# EAGLE design uc4h vl53lxx v0100 (EAGLE 7.5.0)
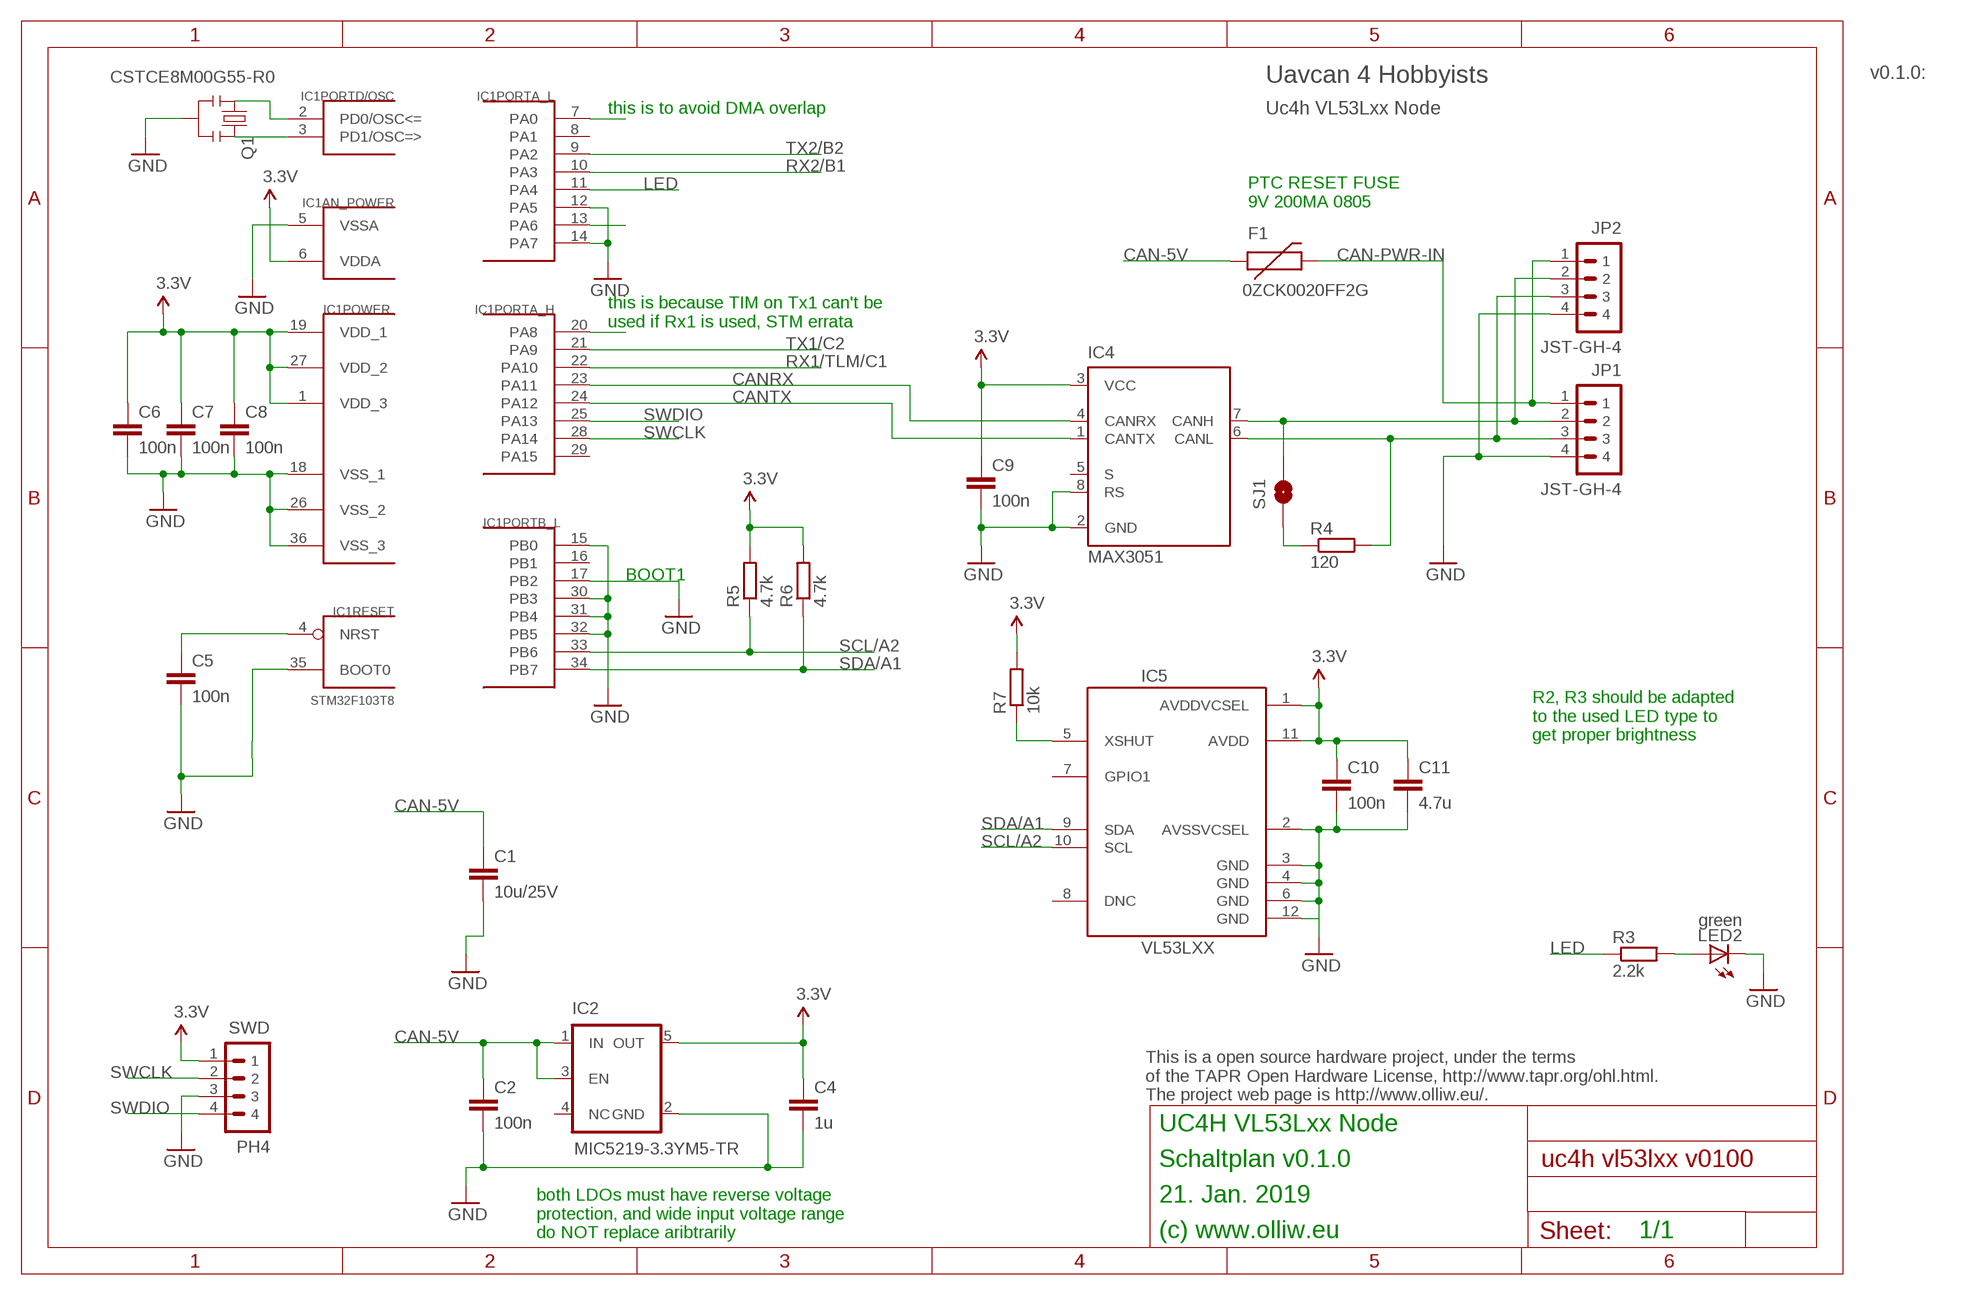
[diagram p0: schematic, sheet 1]

## Parts
C1  10u/25V  C-EUC1206  [C1206]
C2  100n  C-EUC0603K  [C0603K]
C4  1u  C-EUC0603K  [C0603K]
C5  100n  C-EUC0402  [C0402]
C6  100n  C-EUC0402  [C0402]
C7  100n  C-EUC0402  [C0402]
C8  100n  C-EUC0402  [C0402]
C9  100n  C-EUC0402  [C0402]
C10  100n  C-EUC0402  [C0402]
C11  4.7u  C-EUC0603K  [C0603K]
F1  0ZCK0020FF2G  FUSE-PTCFUSE-0805  [FUSE-0805]
IC1  STM32F103T8  STM32F10XTXU6  [VFQFPN36]
IC2  MIC5219-3.3YM5-TR  V_REG_TPS76433SOT23-5  [SOT23-5]
IC4  MAX3051  [SOT23-8]
IC5  VL53LXX  [VL53LXX]
JP1  JST-GH-4  [SM04B-GHS-TB]
JP2  JST-GH-4  [SM04B-GHS-TB]
LED2  green  LEDCHIPLED_0603  [CHIPLED_0603]
Q1  CSTCE8M00G55-R0  RESONATORSMD  [RESONATOR-SMD]
R3  2.2k  R-EU_R0402  [R0402]
R4  120  R-EU_R0402  [R0402]
R5  4.7k  R-EU_R0402  [R0402]
R6  4.7k  R-EU_R0402  [R0402]
R7  10k  R-EU_R0402  [R0402]
SJ1  SOLDERJUMPERNO  [SJ_2S-NO]
SWD  PH4  P4X1_1P27-OCT_BILEX  [4X1_1P27_OCT_BILEX]

## Nets
3.3V: C4.1 C6.1 C7.1 C8.1 C9.1 C10.1 C11.1 IC1.1(POWER:VDD_3) IC1.6(AN_POWER:VDDA) IC1.19(POWER:VDD_1) IC1.27(POWER:VDD_2) IC2.5(OUT) IC4.3(VCC) IC5.1(AVDDVCSEL) IC5.11(AVDD) R5.2 R6.2 R7.2 SWD.1
CAN-5V: C1.1 C2.1 F1.1 IC2.1(IN) IC2.3(EN)
CAN-PWR-IN: F1.2 JP1.1 JP2.1
CANH: IC4.7(CANH) JP1.2 JP2.2 SJ1.2
CANL: IC4.6(CANL) JP1.3 JP2.3 R4.2
CANRX: IC1.23(PORTA_H:PA11) IC4.4(CANRX)
CANTX: IC1.24(PORTA_H:PA12) IC4.1(CANTX)
GND: C1.2 C2.2 C4.2 C5.2 C6.2 C7.2 C8.2 C9.2 C10.2 C11.2 IC1.5(AN_POWER:VSSA) IC1.12(PORTA_L:PA5) IC1.14(PORTA_L:PA7) IC1.15(PORTB_L:PB0) IC1.17(PORTB_L:PB2) IC1.18(POWER:VSS_1) IC1.26(POWER:VSS_2) IC1.30(PORTB_L:PB3) IC1.31(PORTB_L:PB4) IC1.32(PORTB_L:PB5) IC1.35(RESET:BOOT0) IC1.36(POWER:VSS_3) IC2.2(GND) IC4.2(GND) IC4.8(RS) IC5.2(AVSSVCSEL) IC5.3(GND) IC5.4(GND) IC5.6(GND) IC5.12(GND) JP1.4 JP2.4 LED2.C Q1.2 SWD.3
LED: IC1.11(PORTA_L:PA4) R3.1
N$1: C5.1 IC1.4(RESET:NRST)
N$2: LED2.A R3.2
N$4: R4.1 SJ1.1
N$5: IC1.2(PORTD/OSC:PD0/OSC<=) Q1.1
N$6: IC1.3(PORTD/OSC:PD1/OSC=>) Q1.3
N$7: IC1.7(PORTA_L:PA0)
N$8: IC5.5(XSHUT) R7.1
N$9: IC1.13(PORTA_L:PA6)
N$10: IC1.20(PORTA_H:PA8)
RX1/TLM/C1: IC1.22(PORTA_H:PA10)
RX2/B1: IC1.10(PORTA_L:PA3)
SCL/A2: IC1.33(PORTB_L:PB6) IC5.10(SCL) R5.1
SDA/A1: IC1.34(PORTB_L:PB7) IC5.9(SDA) R6.1
SWCLK: IC1.28(PORTA_H:PA14) SWD.2
SWDIO: IC1.25(PORTA_H:PA13) SWD.4
TX1/C2: IC1.21(PORTA_H:PA9)
TX2/B2: IC1.9(PORTA_L:PA2)
Unconnected: IC1.8(PORTA_L:PA1) IC1.16(PORTB_L:PB1) IC1.29(PORTA_H:PA15) IC2.4(NC) IC4.5(S) IC5.7(GPIO1) IC5.8(DNC)

## Notes on the sheet
- v0.1.0:
- Uavcan 4 Hobbyists
- Uc4h VL53Lxx Node
- this is to avoid DMA overlap
- PTC RESET FUSE
  9V 200MA 0805
- this is because TIM on Tx1 can't be
  used if Rx1 is used, STM errata
- BOOT1
- R2, R3 should be adapted
  to the used LED type to
  get proper brightness
- This is a open source hardware project, under the terms
  of the TAPR Open Hardware License, http://www.tapr.org/ohl.html.
  The project web page is http://www.olliw.eu/.
- UC4H VL53Lxx Node
- Schaltplan v0.1.0
- 21. Jan. 2019
- both LDOs must have reverse voltage
  protection, and wide input voltage range
  do NOT replace aribtrarily
- (c) www.olliw.eu | 1/1

## Library data of the parts
C1 C2 C4-C11 = rcl:C-EU: CAPACITOR, European symbol
F1 = # stdlib:FUSE-PTC
IC1 = # stm32:STM32F10XTXU6: STM32F101/103 36pad VFQPFN36
IC2 = # SparkFun2:V_REG_TPS76433: Voltage Regulator Older TI part. LDO 150mA regulator. No output by-pass cap option. See V_REG_LDO for a better part.
IC4 = # stdlib:MAX3051
IC5 = # stdlib:VL53LXX
JP1 JP2 = # stdlib:JST-GH-4
LED2 = led:LED: LED OSRAM: - CHIPLED LG R971, LG N971, LY N971, LG Q971, LY Q971, LO R971, LY R971 LH N974, LH R974 LS Q976, LO Q976, LY Q976 LO Q996 - Hyper CHIPLED LW Q18S LB Q993, LB Q99A, LB R99A - SideLED LS A670, LO A670, LY A670, LG A670, LP A670 LB A673, LV A673, LT A673, LW A673 LH A674 LY A675 LS A676, LA A676, LO A676, LY A676, LW A676 LS A679, LY A679, LG A679 - Hyper Micro SIDELED® LS Y876, LA Y876, LO Y876, LY Y876 LT Y87S - SmartLED LW L88C, LW L88S LB L89C, LB L89S, LG L890 LS L89K, LO L89K, LY L89K LS L896, LA L896, LO L896, LY L896 - TOPLED LS T670, LO T670, LY T670, LG T670, LP T670 LSG T670, LSP T670, LSY T670, LOP T670, LYG T670 LG T671, LOG T671, LSG T671 LB T673, LV T673, LT T673, LW T673 LH T674 LS T676, LA T676, LO T676, LY T676, LB T676, LH T676, LSB T676, LW T676 LB T67C, LV T67C, LT T67C, LS T67K, LO T67K, LY T67K, LW E67C LS E67B, LA E67B, LO E67B, LY E67B, LB E67C, LV E67C, LT E67C LW T67C LS T679, LY T679, LG T679 LS T770, LO T770, LY T770, LG T770, LP T770 LB T773, LV T773, LT T773, LW T773 LH T774 LS E675, LA E675, LY E675, LS T675 LS T776, LA T776, LO T776, LY T776, LB T776 LHGB T686 LT T68C, LB T68C - Hyper Mini TOPLED® LB M676 - Mini TOPLED Santana® LG M470 LS M47K, LO M47K, LY M47K Source: http://www.osram.convergy.de LUXEON: - LUMILED® LXK2-PW12-R00, LXK2-PW12-S00, LXK2-PW14-U00, LXK2-PW14-V00 LXK2-PM12-R00, LXK2-PM12-S00, LXK2-PM14-U00 LXK2-PE12-Q00, LXK2-PE12-R00, LXK2-PE12-S00, LXK2-PE14-T00, LXK2-PE14-U00 LXK2-PB12-K00, LXK2-PB12-L00, LXK2-PB12-M00, LXK2-PB14-N00, LXK2-PB14-P00, LXK2-PB14-Q00 LXK2-PR12-L00, LXK2-PR12-M00, LXK2-PR14-Q00, LXK2-PR14-R00 LXK2-PD12-Q00, LXK2-PD12-R00, LXK2-PD12-S00 LXK2-PH12-R00, LXK2-PH12-S00 LXK2-PL12-P00, LXK2-PL12-Q00, LXK2-PL12-R00 Source: www.luxeon.com KINGBRIGHT: KA-3528ASYC Source: www.kingbright.com
Q1 = # SparkFun2:RESONATOR: Resonator Small SMD resonator. This is the itty bitty 10/20MHz resonators with built in caps. CSTCE10M0G55 and CSTCE20M0V53. Footprint has been reviewed closely but hasn't been tested yet.
R3-R7 = rcl:R-EU_: RESISTOR, European symbol
SJ1 = # SparkFun2:SOLDERJUMPER: Solder Jumper Standard SMD solder jumper. Used to automate production. Two varients : Normally Open and Normally Closed are the same, but have different paste layers. NC will have a large amount of paste and should jumper during reflow.
SWD = # stdlib:P4X1_1P27

## Board
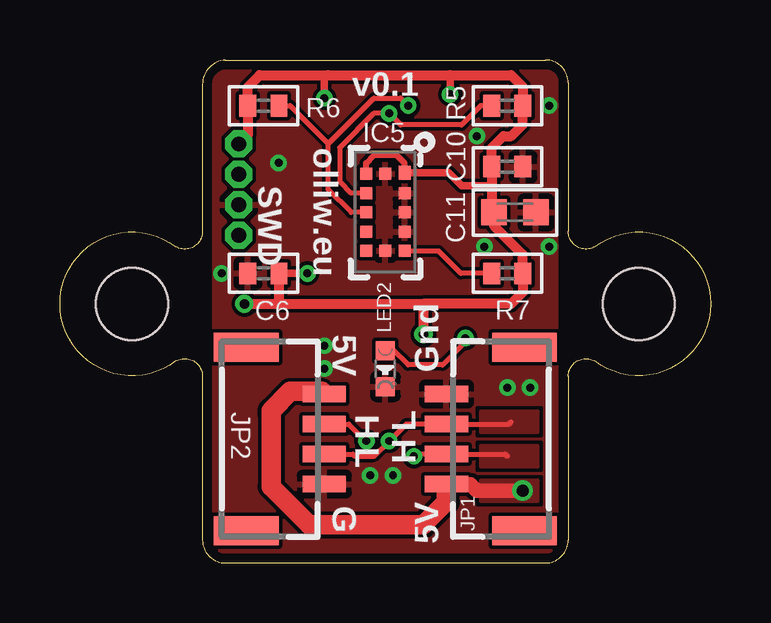
[diagram p1: board, top side]
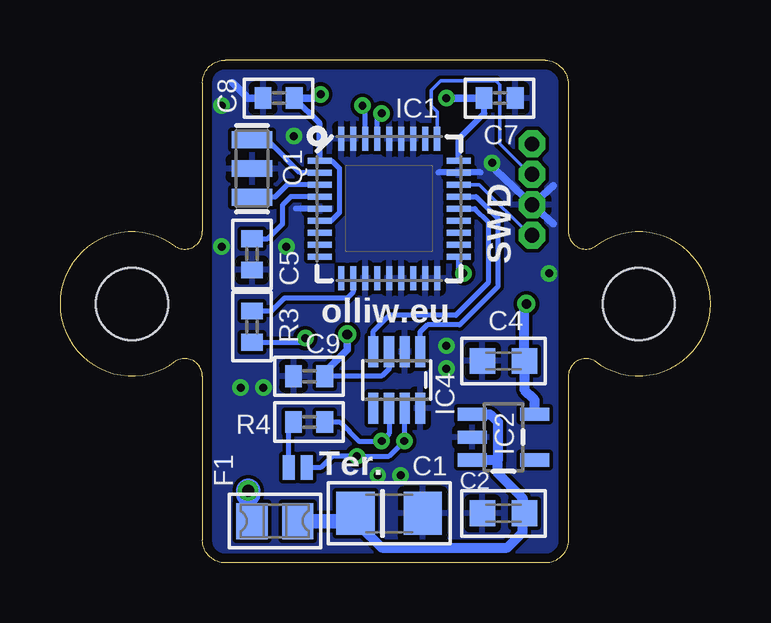
[diagram p2: board, bottom side, seen from below]

Size 27.11 x 20.95 mm. Coordinates in mm from the lower left corner, seen from the top.
Outline: 6.89,0 20.22,0 arc90 21.18,0.95 21.18,7.78 arc-120 22.29,8.41 arc255 22.29,13.18 arc-120 21.18,13.81 21.18,20 arc90 20.22,20.95 6.89,20.95 arc90 5.94,19.84 5.94,13.81 arc-120 4.83,13.18 arc255 4.83,8.41 arc-120 5.94,7.78 5.94,0.95 arc90 6.89,0
Copper layers (1*16): Top 0.0356mm / dielectric 1.5011mm / Bottom 0.0356mm
Design rules "ow-oshpark-2layer": minimum track width 6mil, minimum drill 13mil, track to track 6mil, track to pad 6mil, pad to pad 6mil, via to via 6mil, smd to smd 6mil, copper to edge 15mil, drill to drill 6mil, minimum pad ring 7mil, minimum via ring 7mil, stop-mask expansion 2.5mil, vias tented up to drill 26mil, thermal gap 10mil
Holes 3 mm at 3,10.79 24.11,10.79

### Footprints (pad centres in the part's own frame; a part is rotated, then mirrored left to right if it is on the bottom)
C1206 = smd 1.6 x 1.8: 1 -1.4,0; 2 1.4,0
C0603K = smd 1.05 x 1.08: 1 -0.875,0; 2 0.875,0
C0402 = smd 0.7 x 0.9: 1 -0.65,0; 2 0.65,0
FUSE-0805 = smd 1.3 x 1.5: 1 -0.95,0; 2 0.95,0
VFQFPN36 = smd 1 x 0.25: 1 -2.9,2; 2 -2.9,1.5; 3 -2.9,1; 4 -2.9,0.5; 5 -2.9,0; 6 -2.9,-0.5; 7 -2.9,-1; 8 -2.9,-1.5; 9 -2.9,-2; 19 2.9,-2; 20 2.9,-1.5; 21 2.9,-1; 22 2.9,-0.5; 23 2.9,0; 24 2.9,0.5; 25 2.9,1; 26 2.9,1.5; 27 2.9,2 | smd 0.25 x 1: 10 -2,-2.9; 11 -1.5,-2.9; 12 -1,-2.9; 13 -0.5,-2.9; 14 0,-2.9; 15 0.5,-2.9; 16 1,-2.9; 17 1.5,-2.9; 18 2,-2.9; 29 1.5,2.9; 30 1,2.9; 31 0.5,2.9; 32 0,2.9; 33 -0.5,2.9; 34 -1,2.9; 35 -1.5,2.9; 36 -2,2.9 | smd 0.27 x 1: 28 2,2.9
SOT23-5 = smd 0.55 x 1.2: 1 -0.95,-1.3; 2 0,-1.3; 3 0.95,-1.3; 4 0.95,1.3; 5 -0.95,1.3
SOT23-8 = smd 0.42 x 1.3: 1 -0.975,-1.175; 2 -0.325,-1.175; 3 0.325,-1.175; 4 0.975,-1.175; 5 0.975,1.175; 6 0.325,1.175; 7 -0.325,1.175; 8 -0.975,1.175
VL53LXX = smd 0.6 x 0.5: 1 1.65,-0.8 | smd 0.5 x 0.5: 2 0.8,-0.8; 3 0,-0.8; 4 -0.8,-0.8; 5 -1.6,-0.8; 6 -1.6,0; 7 -1.6,0.8; 8 -0.8,0.8; 9 0,0.8; 10 0.8,0.8; 11 1.6,0.8; 12 1.6,0
SM04B-GHS-TB = smd 0.7 x 1.8: 1 -1.875,4.6; 2 -0.625,4.6; 3 0.625,4.6; 4 1.875,4.6 | smd 1.2 x 2.7: FIT@1 -3.825,1.35; FIT@2 3.825,1.35
CHIPLED_0603 = smd 0.8 x 0.8: A 0,-0.75; C 0,0.75
RESONATOR-SMD = smd 0.7 x 1.7: 1 -1.2,0; 2 0,0; 3 1.2,0
R0402 = smd 0.7 x 0.9: 1 -0.65,0; 2 0.65,0
SJ_2S-NO = smd 0.508 x 1.016: 1 -0.381,0; 2 0.381,0
4X1_1P27_OCT_BILEX = drill 0.61 pad 1.118 octagon: 1 0,0; 2 0,-1.27; 3 0,-2.54; 4 0,-3.81

### Placement (x,y rotation side)
C1  13.4,2.06 0 bottom
C2  8.64,2.06 180 bottom
C4  8.64,8.41 180 bottom
C5  19.11,12.86 270 bottom
C6  8.48,12.06 180 top
C7  8.79,19.37 0 bottom
C8  18,19.37 180 bottom
C9  16.73,7.78 180 bottom
C10  18.64,16.51 0 top
C11  18.95,14.61 0 top
F1  18.16,1.75 180 bottom
IC1  13.4,14.76 0 bottom
IC2  8.64,5.24 270 bottom
IC4  13.08,7.62 180 bottom
IC5  13.56,14.61 90 top
JP1  20.7,5.16 90 top
JP2  6.41,5.16 270 top
LED2  13.56,8.1 180 top
Q1  19.11,16.43 270 bottom
R3  19.11,9.84 270 bottom
R4  16.73,5.87 0 bottom
R5  18.64,19.05 0 top
R6  8.48,19.05 180 top
R7  18.64,12.06 0 top
SJ1  17.21,3.97 0 bottom
SWD  7.45,17.46 0 top

### Tracks (layer width: path | path; a pad name or v marks a point on that pad's centre or on a via)
3.3V  (via drill 0.33, 0.4)
  Top 0.152: 11.02,20.16 11.18,20.32
  Top 0.254: IC5.1 14.36,16.66 14.03,16.99 13.08,16.99 12.76,16.66 IC5.11
  Top 0.305: IC5.1 16.19,16.25 16.73,15.72 18,15.72 | C6.1 v10.3,12.06 | v11.02,19.37 11.02,20.16 | v16.26,19.53 16.26,20.32
  Top 0.406: v7.68,10.79 9.11,10.79 | 9.11,10.79 15.15,10.79 | SWD.1 7.83,17.84 R6.2 7.83,19.83 8.32,20.32 11.18,20.32 16.26,20.32 18.8,20.32 19.27,19.84 19.27,19.07 R5.2 19.27,19.04 19.27,18.26 18.8,17.78 18.48,17.78 17.99,17.29 C10.1 18,16.5 18,15.72 18,14.92 18.08,14.69 C11.1 18.08,14.05 19.29,12.84 R7.2 19.29,11.29 18.8,10.79 15.15,10.79 | C6.1 9.11,11.91 9.11,10.79 | 15.15,10.79 v15.15,9.53
  Bottom 0.203: IC4.3 13.41,8.09 13.72,7.78 C9.1 | IC1.6 15.8,14.26 15.46,14.61 15.46,16.43 15.8,16.76 IC1.1
  Bottom 0.254: IC1.19 10.5,12.26 v10.3,12.06 | IC1.27 10.5,17.66 9.43,18.73 9.43,19.51 | IC1.1 16.3,18.31 C8.1
  Bottom 0.305: v15.15,9.53 15.15,8.89 16.08,7.95 C9.1 | v11.02,19.37 C7.1 9.43,19.51 | C8.1 16.42,19.37 v16.26,19.53
  Bottom 0.406: v7.68,10.79 7.76,10.71 C4.1 7.76,7.22 7.34,6.8 IC2.5
CAN-5V
  Bottom 0.406: IC2.1 9.19,6.19 8.87,5.87 8.87,4.29 | 8.87,4.29 IC2.3 | 15.3,1.75 C1.1 14.64,1.56 13.72,0.64 8.48,0.64 7.84,1.27 7.84,1.82 C2.1 7.84,2.15 7.84,2.7 8.87,3.73 8.87,4.29
  Bottom 0.61: F1.1 15.3,1.75
CAN-PWR-IN  (via drill 0.5)
  Top 0.152: 16.1,3.21 JP1.1
  Top 0.406: 8.8,6.19 8.8,6.35 | 10.9,7.14 JP2.1
  Top 0.61: JP1.1 17.1,3.28 17.37,3.02 v19.27,3.02
  Top 0.813: 8.8,6.19 8.8,3.17 10.38,1.59 15.15,1.59 16.1,2.54 16.1,3.21 | 8.8,6.35 9.59,7.14 10.9,7.14
  Bottom 0.406: 19.27,1.91 F1.2
  Bottom 0.61: 19.27,2.86 19.27,1.91
  Bottom 1.016: 19.27,2.86 v19.27,3.02
  pour Top (no thermals): 17.53,3.45 17.53,2.58 19.91,2.58 19.91,3.45
CANH  (via drill 0.33)
  Top 0.203: JP2.2 12.04,5.78 v12.76,5.08 | 18.64,4.45 18.55,4.53 JP1.2 14.84,4.53 v14.75,4.45
  Bottom 0.152: 12.76,6.44 IC4.7
  Bottom 0.203: SJ1.2 16.26,3.97 15.78,4.45 v14.75,4.45 13.4,4.45 v12.76,5.08 12.76,6.44
  pour Top (no thermals): 17.53,4.01 17.53,4.88 19.91,4.88 19.91,4.01
CANL  (via drill 0.33)
  Top 0.203: JP2.3 12.2,4.53 12.29,4.45 13.08,4.45 v13.72,5.08 14.42,5.78 JP1.3 18.71,5.78 18.8,5.87
  Bottom 0.203: IC4.6 13.41,5.39 v13.72,5.08 14.67,5.08 15.46,5.87 R4.2
  pour Top (no thermals): 17.53,5.44 17.53,6.31 19.91,6.31 19.91,5.44
CANRX
  Bottom 0.203: IC1.23 9.83,14.76 9.27,14.21 9.27,11.67 10.62,10.32 13.4,10.32 14.06,9.66 IC4.4
CANTX
  Bottom 0.203: IC1.24 9.77,15.26 8.87,14.37 8.87,11.51 10.46,9.92 11.81,9.92 12.11,9.63 IC4.1
GND  (via drill 0.33)
  Bottom 0.254: 9.59,16.27 11.33,16.27 | 15.94,14.76 17.29,14.76
  Bottom 0.305: SWD.3 8.95,16.35 | C8.2 19.27,19.37 19.91,20 | 6.57,14.13 SWD.3 | SWD.3 6.57,15.72
  other vias: 19.59,7.3 11.02,9.05 13.87,3.65 12.92,3.65 20.38,13.18 20.38,19.05 17.37,17.78 9.11,16.67 18.64,7.3 17.68,13.18 6.73,12.06 11.02,8.1
  pour Top (isolate 0.152, rank 6): 6.41,20.64 20.7,20.64 20.7,0.16 6.41,0.16
  pour Top (isolate 0.152, rank 6): 6.41,20.64 20.7,20.64 20.7,0.16 6.41,0.16
  pour Bottom: 6.41,20.64 20.7,20.64 20.7,0.16 6.41,0.16
LED
  Bottom 0.152: 19.26,10.48 R3.1
  Bottom 0.203: IC1.11 14.9,11.28 15.15,11.03 17.76,11.03 18.32,10.48 19.26,10.48
N$1
  Bottom 0.203: IC1.4 17.5,15.26 17.84,14.92 17.84,14.13 18.46,13.51 C5.1
N$2  (via drill 0.33)
  Top 0.152: 13.6,8.89 LED2.A
  Top 0.203: v16.89,9.37 16.89,9.21 15.94,8.26 14.51,8.26 13.87,8.89 13.6,8.89
  Bottom 0.203: R3.2 17.06,9.19 v16.89,9.37
N$4
  Bottom 0.152: 17.35,5.61 R4.1 17.59,5.67
  Bottom 0.203: SJ1.1 17.59,5.67
N$5
  Bottom 0.152: 18.87,17.46 Q1.1
  Bottom 0.203: IC1.2 17.12,16.26 18.32,17.46 18.87,17.46
N$6
  Bottom 0.152: 19.2,15.24 Q1.3
  Bottom 0.203: IC1.3 17.64,15.76 18.16,15.24 19.2,15.24
N$8
  Top 0.203: IC5.5 15.77,13.01 16.71,12.06 R7.1
SCL/A2  (via drill 0.33)
  Top 0.203: IC5.10 12.12,15.4 11.65,15.88 11.65,17.3 13.08,18.73 v13.72,18.73 14.19,18.26 16.73,18.26 17.53,19.05 R5.1
  Bottom 0.203: IC1.33 13.9,18.55 v13.72,18.73
SDA/A1  (via drill 0.33)
  Top 0.203: IC5.9 12.13,14.61 11.18,15.56 11.18,17.46 | 11.18,17.46 13.08,19.37 14.19,19.37 v14.51,19.05 | R6.1 9.59,19.05 11.18,17.46
  Bottom 0.203: IC1.34 14.4,18.94 v14.51,19.05
SWCLK
  Bottom 0.152: IC1.28 11.4,18.8 11.65,19.05 11.65,19.68 11.26,20.08 8.95,20.08 8.8,19.92 8.8,17.46 7.53,16.19 SWD.2
SWDIO
  Bottom 0.152: IC1.25 9.64,15.76 7.53,13.65 SWD.4

### Text on the board
tNames: v0.1 | IC5 | olliw.eu | SWD | 5V | Gnd | H | L | L | H | G | 5V
bNames: SWD | olliw.eu | Ter.